# EAGLE design Ring_opto_interface_v2.1 (EAGLE 9.6.1)
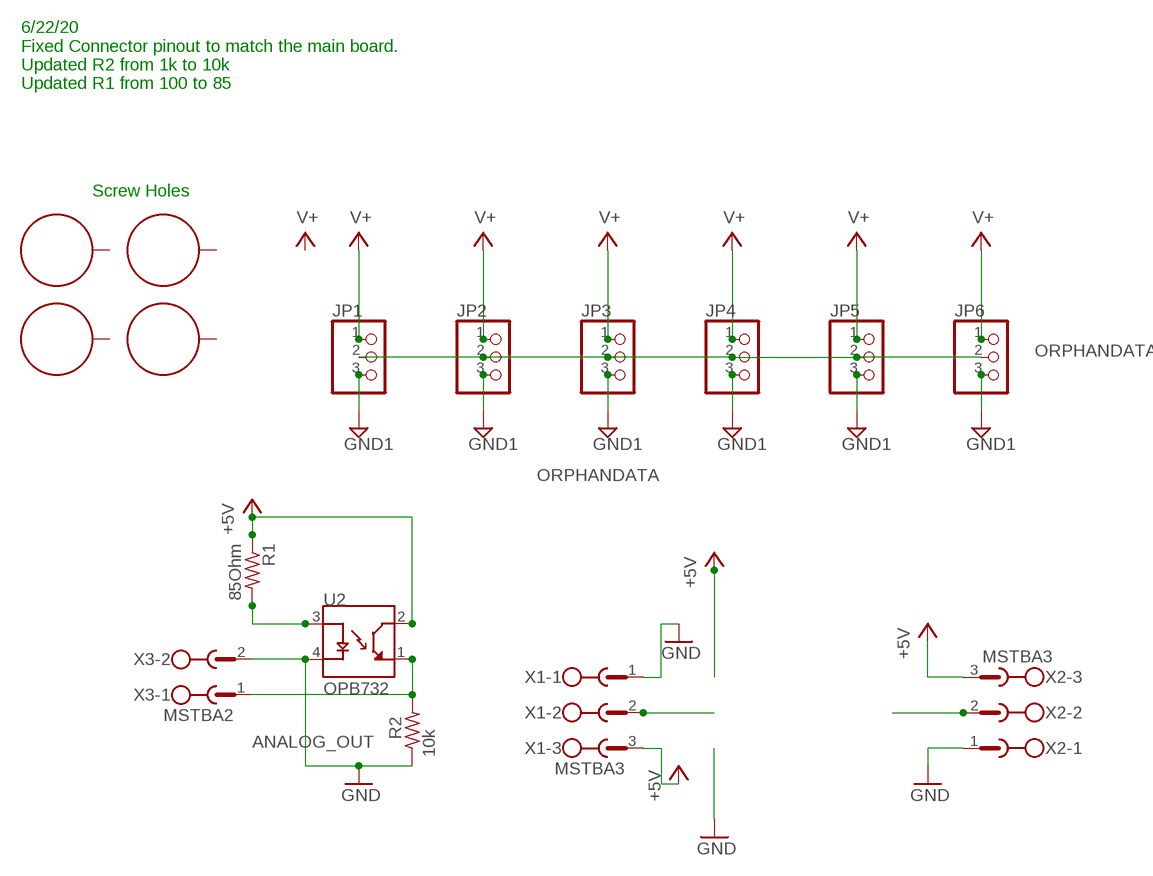
[diagram p0: schematic, sheet 1]

## Parts
H1  STANDOFF_ELECTRICAL5-32  [STANDOFF_ELECTRICAL_5_32]
H2  STANDOFF_ELECTRICAL5-32  [STANDOFF_ELECTRICAL_5_32]
H3  STANDOFF_ELECTRICAL5-32  [STANDOFF_ELECTRICAL_5_32]
H4  STANDOFF_ELECTRICAL5-32  [STANDOFF_ELECTRICAL_5_32]
JP1  PINHD-1X3CB  [1X03-CLEANBIG]
JP2  PINHD-1X3CB  [1X03-CLEANBIG]
JP3  PINHD-1X3CB  [1X03-CLEANBIG]
JP4  PINHD-1X3CB  [1X03-CLEANBIG]
JP5  PINHD-1X3CB  [1X03-CLEANBIG]
JP6  PINHD-1X3CB  [1X03-CLEANBIG]
R1  85Ohm  R-US_AXIAL-11.7MM-PITCH  [RESAD1176W63L850D250B]
R2  10k  R-US_AXIAL-11.7MM-PITCH  [RESAD1176W63L850D250B]
U2  OPB732  [OPTO_OPB732]
X1  MSTBA3  [MSTBA3]
X2  MSTBA3  [MSTBA3]
X3  MSTBA2  [MSTBA2]

## Nets
+5V: R1.1 U2.2(CT) X1.3 X2.3
ANALOG_OUT: R2.2 U2.1(ET) X3.1
GND: R2.1 U2.4(C) X1.1 X2.1 X3.2
GND1: JP1.3 JP2.3 JP3.3 JP4.3 JP5.3 JP6.3
N$1: R1.2 U2.3(A)
N$2: X1.2
N$3: X2.2
ORPHANDATA: JP1.2 JP2.2 JP3.2 JP4.2 JP5.2 JP6.2
V+: JP1.1 JP2.1 JP3.1 JP4.1 JP5.1 JP6.1
Unconnected: H1.P1 H2.P1 H3.P1 H4.P1

## Notes on the sheet
- 6/22/20
  Fixed Connector pinout to match the main board.
  Updated R2 from 1k to 10k
  Updated R1 from 100 to 85
- Screw Holes

## Library data of the parts
H1-H4 = th_libraries:STANDOFF_ELECTRICAL: A standoff intended to be an electrically connected point. Pad size and stop size allow for a #8 Phillips pan screw head to make a solid connection to the board. Added 144mill drill hole that fits my normal wood screw
JP1-JP6 = adafruit:PINHD-1X3: PIN HEADER
R1 R2 = Resistor:R-US: Resistor Fixed - ANSI; CATEGORY: Resistor; SUB-CATEGORY: Fixed
U2 = OPB732:OPB732: Optoswitch; Leaded Process Compatible: Ye; Optoswitch; Leaded Process Compatible: Yes; DESCRIPTION: Reflective Optical Sensor 3 _76.2mm_ PCB Mount; MF: TT Electronics/Optek; MP: OPB732; PACKAGE: PCB Mount Optek
X1 X2 = con-phoenix-508:MSTBA3: PHOENIX; MF: FARNELL; MPN: 1757255; OC_FARNELL: 3705183; OC_NEWARK: 71C4162
X3 = con-phoenix-508:MSTBA2: PHOENIX; MF: FARNELL; MPN: 1757242; OC_FARNELL: 3705171; OC_NEWARK: 71C4161

## Board
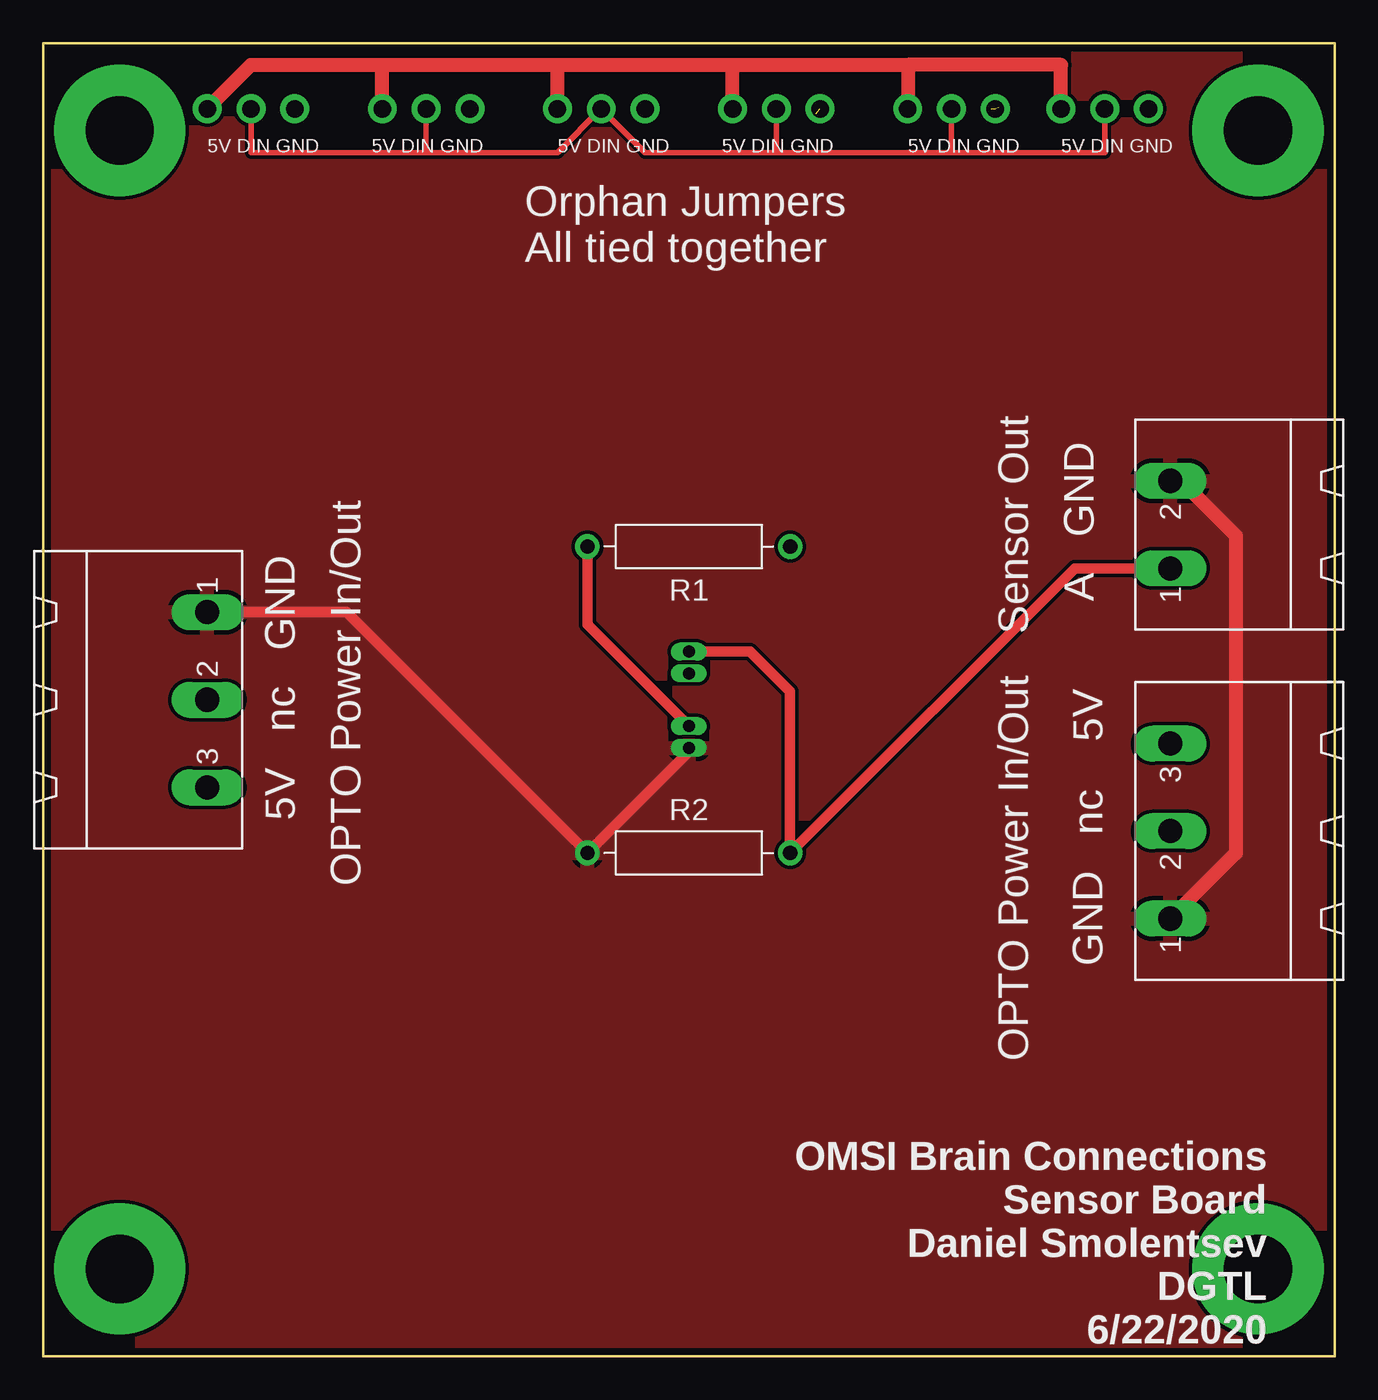
[diagram p1: board, top side]
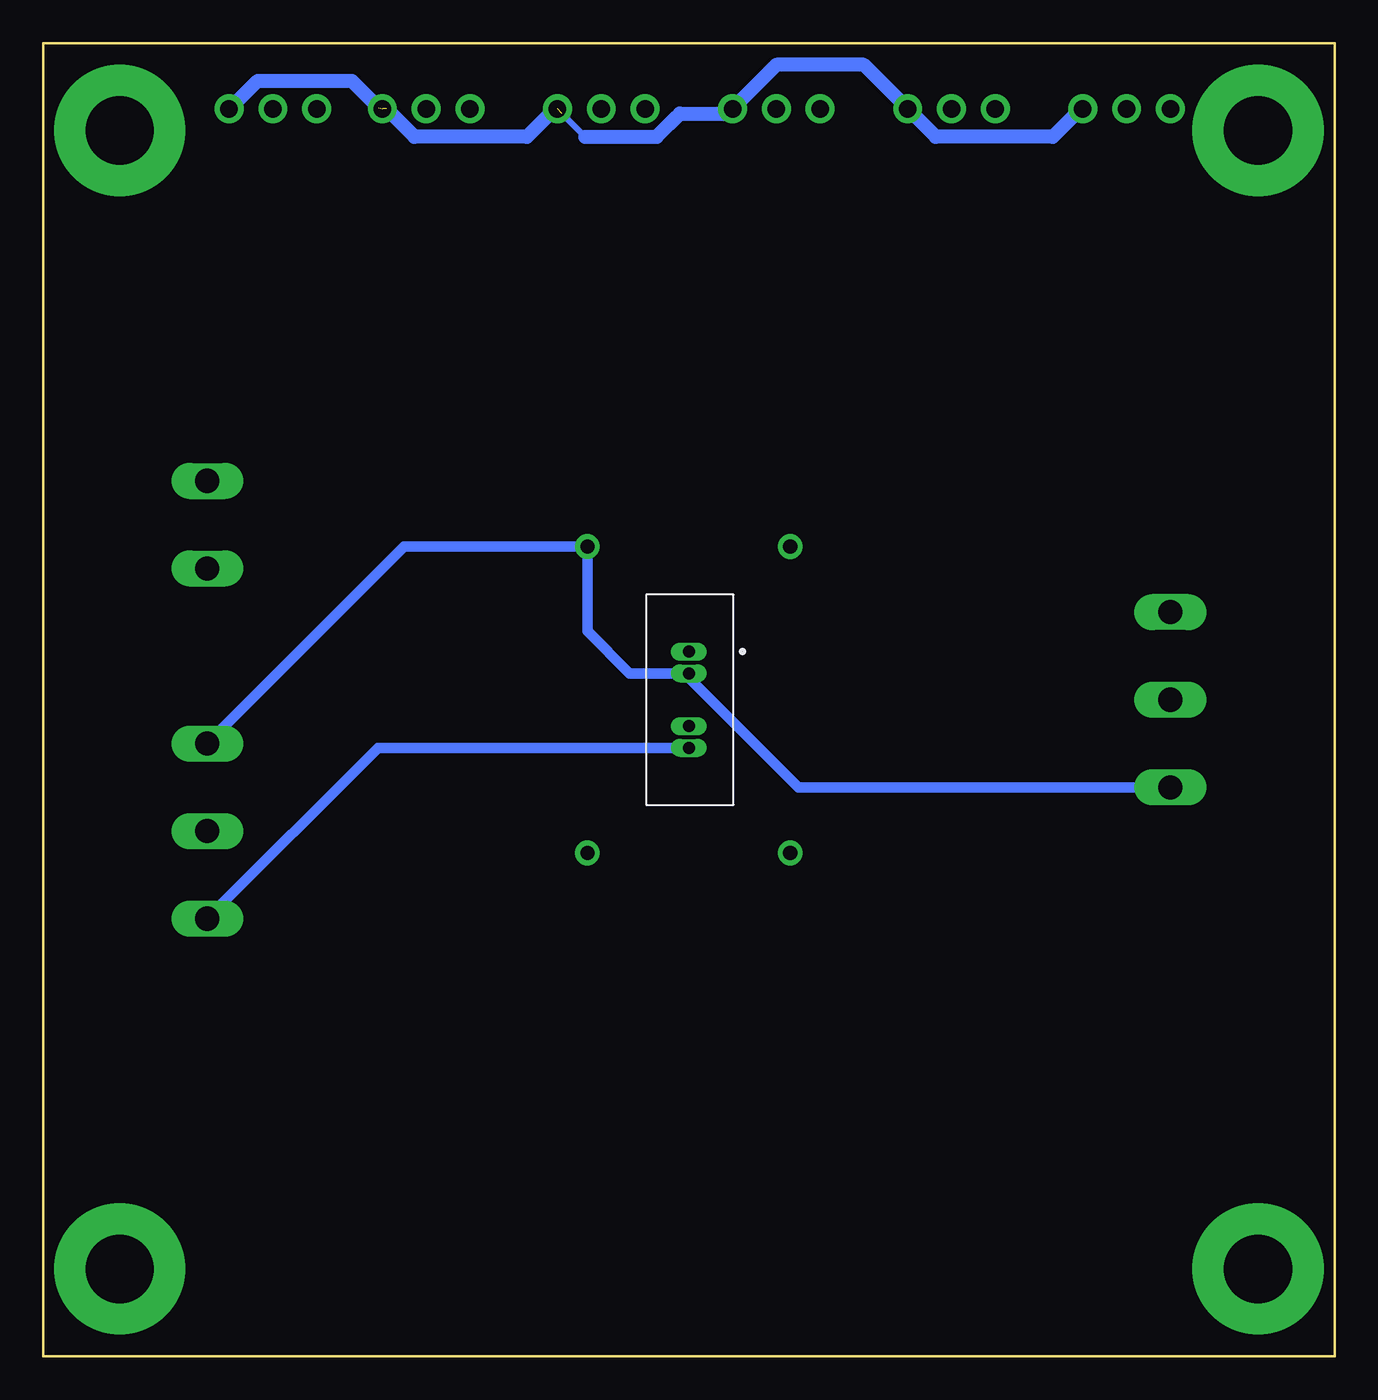
[diagram p2: board, bottom side, seen from below]

Size 74.93 x 76.2 mm. Coordinates in mm from the lower left corner, seen from the top.
Outline: 0,0 0,76.2 74.93,76.2 74.93,0 0,0
Copper layers (1*16): Top 0.035559375mm / dielectric 1.6mm / Bottom 0.035559375mm
Design rules "oshpark-2layer_8mil": minimum track width 8mil, minimum drill 10mil, track to track 8mil, track to pad 8mil, pad to pad 8mil, via to via 8mil, smd to smd 8mil, copper to edge 15mil, drill to drill 8mil, minimum pad ring 5mil, minimum via ring 5mil, stop-mask expansion 2.5mil, vias tented up to drill 0mil, thermal gap 10mil

### Footprints (pad centres in the part's own frame; a part is rotated, then mirrored left to right if it is on the bottom)
STANDOFF_ELECTRICAL_5_32 = drill 3.969 pad 7.62: P1 0,0
1X03-CLEANBIG = drill 1.016 pad 1.676: 1 -2.54,0; 2 0,0; 3 2.54,0
RESAD1176W63L850D250B = drill 0.83 pad 1.43: 1 -5.88,0; 2 5.88,0
OPTO_OPB732 = drill 0.7 pad 0.813 long: 1 -2.795,0; 2 -1.525,0; 3 1.525,0; 4 2.795,0
MSTBA3 = drill 1.397 long: 1 -5.08,5.08; 2 0,5.08; 3 5.08,5.08
MSTBA2 = drill 1.397 long: 1 -2.54,5.08; 2 2.54,5.08

### Placement (x,y rotation side)
H1  70.48,5.08 0 top
H2  4.45,5.08 0 top
H3  70.48,71.12 0 top
H4  4.45,71.12 0 top
JP1  52.71,72.39 0 top
JP2  42.55,72.39 0 top
JP3  32.39,72.39 0 top
JP4  22.22,72.39 0 top
JP5  12.07,72.39 0 top
JP6  61.59,72.39 0 top
R1  37.47,46.99 180 top
R2  37.47,29.21 0 top
U2  37.47,38.1 270 bottom
X1  4.45,38.1 270 top
X2  70.48,30.48 90 top
X3  70.48,48.26 90 top

### Tracks (layer width: path | path; a pad name or v marks a point on that pad's centre or on a via)
+5V
  Bottom 0.61: X2.3 53.98,46.99 R1.1 43.35,42.07 40.9,39.62 U2.2 37.47,39.37 31.11,33.02 X1.3
ANALOG_OUT
  Top 0.61: U2.1 41.02,40.89 43.35,38.57 R2.2 59.86,45.72 X3.1
GND
  Top 0.61: X1.1 17.61,43.18 R2.1 37.47,35.09 U2.4
  Top 0.813: X3.2 66.04,50.8 69.22,47.62 69.22,29.21 X2.1
  Bottom 0.61: X2.1 55.5,35.3 U2.4
  pour Top: -0.63,78.11 76.84,78.11 78.11,76.84 78.11,-0.64 -1.27,-0.64 -1.9,0 -1.9,76.84
GND1  (3 unrouted)
  Bottom 0.305: 45.17,72.45 JP2.3 | 44.83,72.11 43.46,70.74 39.69,70.74 38.32,72.11 35.23,72.11 JP3.3 34.89,72.11 | 14.66,72.45 JP5.3
  Bottom 0.813: 55,72.39 53.38,70.76 46.86,70.76 45.17,72.45 | 34.89,72.11 37.98,72.11 39.33,70.76 43.46,70.76 | 14.66,72.45 16.34,70.76 23.14,70.76 JP4.3 27.3,74.93 32.39,74.93 JP3.3 | JP6.3 64.1,72.39 62.47,74.02 57.02,74.02 55.46,72.45
N$1
  Top 0.61: U2.3 31.58,42.45 R1.2
N$2
  Bottom 0.305: 9.59,38.16 X1.2
ORPHANDATA
  Top 0.305: JP5.2 12.07,69.85 22.22,69.85 | 22.22,69.85 JP4.2 | 22.22,69.85 29.85,69.85 JP3.2 34.93,69.85 42.55,69.85 | JP2.2 42.55,69.85 | 42.55,69.85 52.71,69.85 | JP1.2 52.71,69.85 | JP6.2 61.59,69.85 52.71,69.85
V+
  Top 0.813: 19.68,74.93 12.07,74.93 JP5.1 | 19.68,74.93 29.85,74.93 | 29.85,74.93 40.01,74.93 | 40.01,74.93 50.17,74.93 | 50.17,74.93 59.05,74.93 JP6.1 | 50.17,74.93 JP1.1 | JP2.1 40.01,74.93 | JP4.1 19.68,74.93 | JP3.1 29.85,74.93

### Text on the board
tPlace: A GND | Sensor Out | GND nc 5V | 5V nc GND | OPTO Power In/Out | OPTO Power In/Out | OMSI Brain Connections / Sensor Board / Daniel Smolentsev / DGTL / 6/22/2020
tNames: 5V DIN GND | 5V DIN GND | 5V DIN GND | 5V DIN GND | 5V DIN GND | 5V DIN GND | Orphan Jumpers / All tied together